# EAGLE design Extender-TI74 (EAGLE 7.7.0)
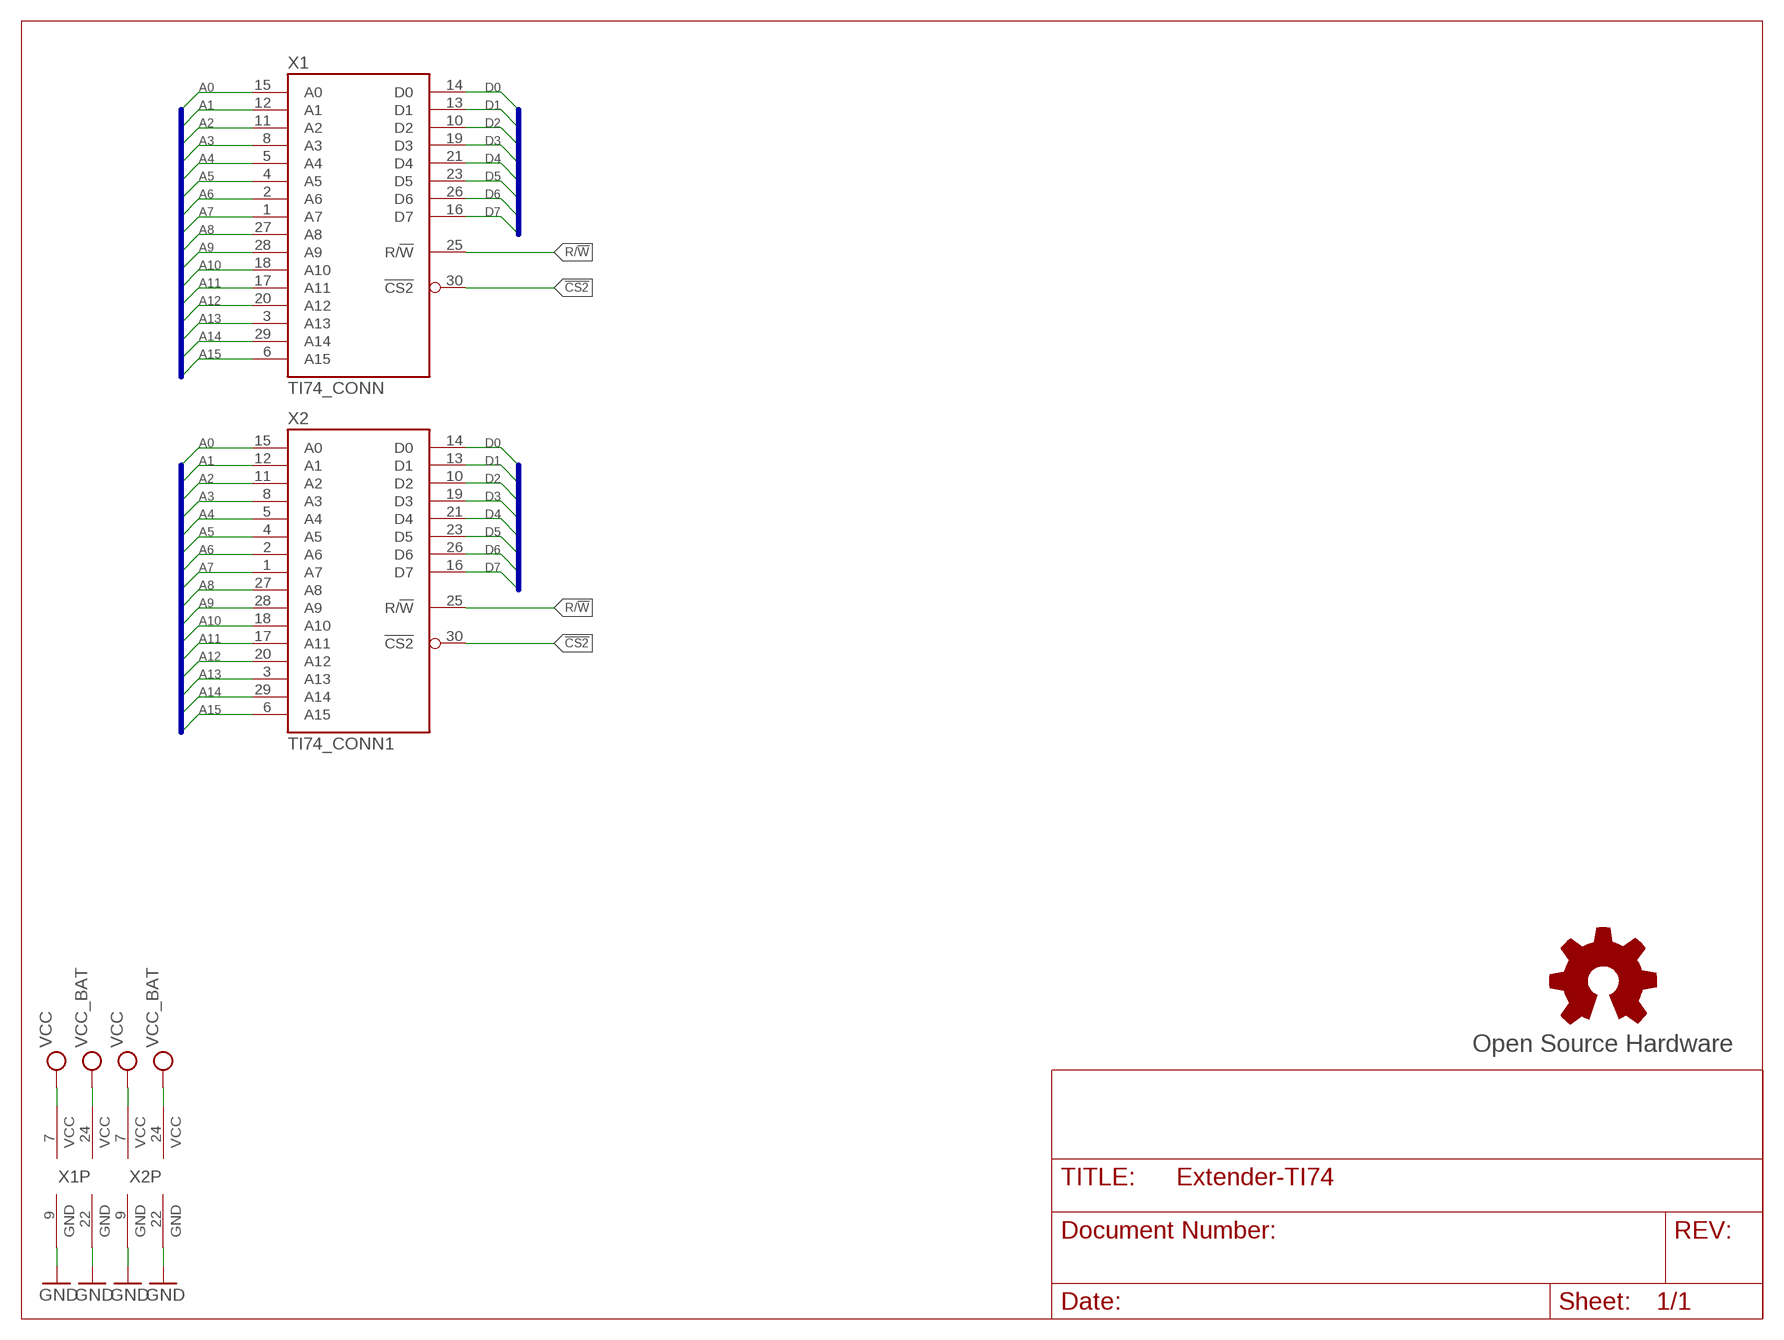
[diagram p0: schematic, sheet 1]

## Parts
GOLD_ORB_SM1  Open Source Hardware  OSHWLOGOLOGO5MM  [OSHW_5MM]
X1  TI74_CONN  [FE050-15-2SHORT]
X2  TI74_CONN1  [MA050-15-2]

## Nets
!CS2: X1.30(!CS2) X2.30(!CS2)
A0: X1.15(A0) X2.15(A0)
A1: X1.12(A1) X2.12(A1)
A2: X1.11(A2) X2.11(A2)
A3: X1.8(A3) X2.8(A3)
A4: X1.5(A4) X2.5(A4)
A5: X1.4(A5) X2.4(A5)
A6: X1.2(A6) X2.2(A6)
A7: X1.1(A7) X2.1(A7)
A8: X1.27(A8) X2.27(A8)
A9: X1.28(A9) X2.28(A9)
A10: X1.18(A10) X2.18(A10)
A11: X1.17(A11) X2.17(A11)
A12: X1.20(A12) X2.20(A12)
A13: X1.3(A13) X2.3(A13)
A14: X1.29(A14) X2.29(A14)
A15: X1.6(A15) X2.6(A15)
D0: X1.14(D0) X2.14(D0)
D1: X1.13(D1) X2.13(D1)
D2: X1.10(D2) X2.10(D2)
D3: X1.19(D3) X2.19(D3)
D4: X1.21(D4) X2.21(D4)
D5: X1.23(D5) X2.23(D5)
D6: X1.26(D6) X2.26(D6)
D7: X1.16(D7) X2.16(D7)
GND: X1.9(GND) X1.22(GND) X2.9(GND) X2.22(GND)
R/!W: X1.25(R/!W) X2.25(R/!W)
VCC: X1.7(VCC) X2.7(VCC)
VCCBAT: X1.24(VCC_RAM) X2.24(VCC_RAM) ; supply symbol labelled VCC_BAT

## Buses
A[0..15]
D[0..7]

## Library data of the parts
GOLD_ORB_SM1 = oshw:OSHWLOGO: The OSHW logo for PCB layout
X1 X2 = ti74:TI74_CONN

## Board
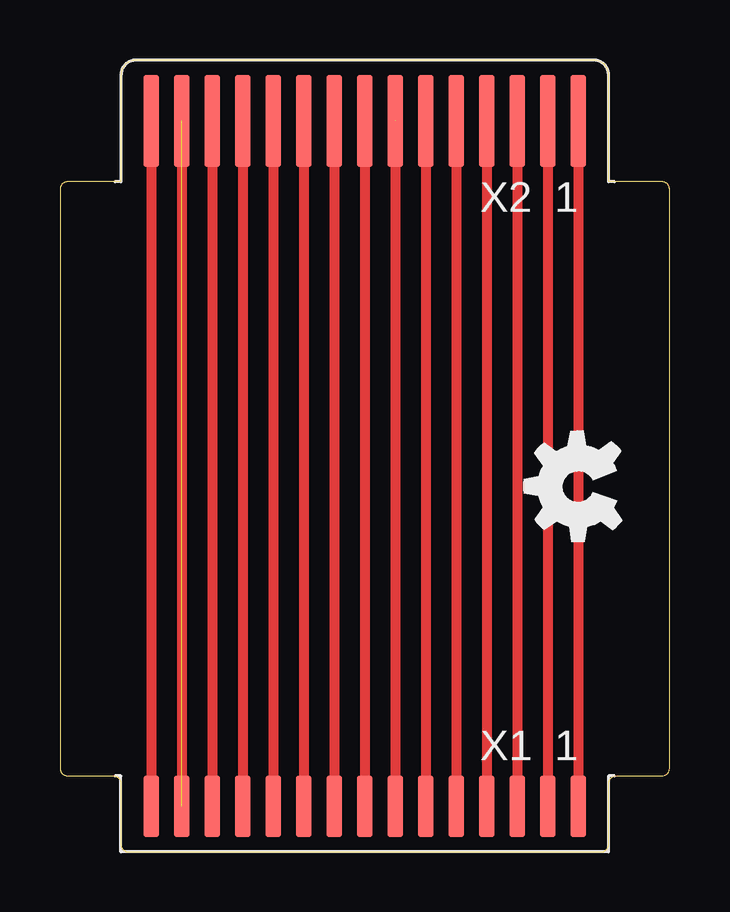
[diagram p1: board, top side]
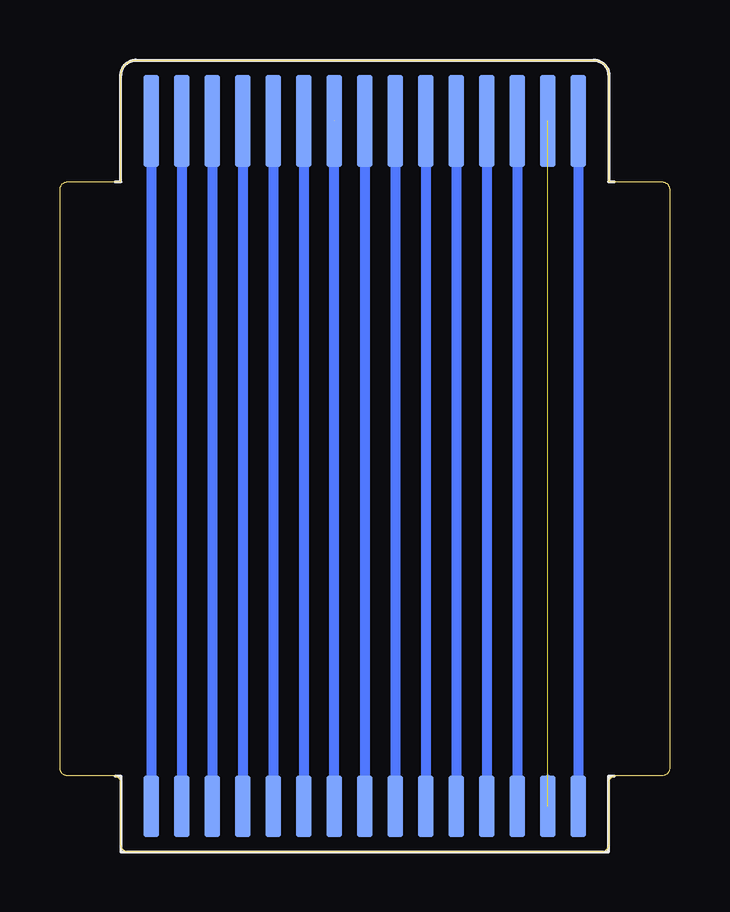
[diagram p2: board, bottom side, seen from below]

Size 25.4 x 33.02 mm. Coordinates in mm from the lower left corner, seen from the top.
Outline: 25.4,3.49 25.4,27.62 arc90 25.08,27.94 22.86,27.94 22.86,32.38 arc90 22.23,33.02 3.17,33.02 arc90 2.54,32.38 2.54,27.94 0.32,27.94 arc90 0,27.62 0,3.49 arc90 0.32,3.17 2.22,3.17 arc-90 2.54,2.86 2.54,0.32 arc90 2.86,0 22.54,0 arc90 22.86,0.32 22.86,2.86 arc-90 23.18,3.17 25.08,3.17 arc90 25.4,3.49
Copper layers (1*16): Top 0.035mm / dielectric 1.5mm / Bottom 0.035mm
Design rules "hackvana *": minimum track width 6mil, minimum drill 0.3mm, track to track 6mil, track to pad 6mil, pad to pad 6mil, via to via 6mil, smd to smd 0mil, copper to edge 6mil, drill to drill 6mil, minimum pad ring 10mil, minimum via ring 6mil, stop-mask expansion 2mil, vias tented up to drill 100mil, thermal gap 10mil

### Footprints (pad centres in the part's own frame; a part is rotated, then mirrored left to right if it is on the bottom)
FE050-15-2SHORT = smd 0.635 x 2.54: 1 8.89,0; 2 7.62,0; 3 6.35,0; 4 5.08,0; 5 3.81,0; 6 2.54,0; 7 1.27,0; 8 0,0; 9 -1.27,0; 10 -2.54,0; 11 -3.81,0; 12 -5.08,0; 13 -6.35,0; 14 -7.62,0; 15 -8.89,0 | smd 0.635 x 2.54 bottom: 16 -8.89,0; 17 -7.62,0; 18 -6.35,0; 19 -5.08,0; 20 -3.81,0; 21 -2.54,0; 22 -1.27,0; 23 0,0; 24 1.27,0; 25 2.54,0; 26 3.81,0; 27 5.08,0; 28 6.35,0; 29 7.62,0; 30 8.89,0
MA050-15-2 = smd 0.635 x 3.81: 1 8.89,0; 2 7.62,0; 3 6.35,0; 4 5.08,0; 5 3.81,0; 6 2.54,0; 7 1.27,0; 8 0,0; 9 -1.27,0; 10 -2.54,0; 11 -3.81,0; 12 -5.08,0; 13 -6.35,0; 14 -7.62,0; 15 -8.89,0 | smd 0.635 x 3.81 bottom: 16 -8.89,0; 17 -7.62,0; 18 -6.35,0; 19 -5.08,0; 20 -3.81,0; 21 -2.54,0; 22 -1.27,0; 23 0,0; 24 1.27,0; 25 2.54,0; 26 3.81,0; 27 5.08,0; 28 6.35,0; 29 7.62,0; 30 8.89,0

### Placement (x,y rotation side)
GOLD_ORB_SM1  21.59,15.24 90 top
X1  12.7,1.91 180 top
X2  12.7,30.48 180 top

### Tracks (layer width: path | path; a pad name or v marks a point on that pad's centre or on a via)
!CS2
  Bottom 0.406: X2.30 X1.30
A0
  Top 0.152: X1.15 21.59,3.17
  Top 0.406: X2.15 X1.15
A1
  Top 0.406: X2.12 X1.12
A2
  Top 0.152: X1.11 16.51,3.17
  Top 0.406: X2.11 X1.11
A3
  Top 0.406: X2.8 X1.8 12.7,1.27
A4
  Top 0.406: X2.5 X1.5
A5
  Top 0.406: X2.4 X1.4
A6
  Top 0.406: X2.2 X1.2
A7
  Top 0.406: X2.1 X1.1
A8
  Bottom 0.152: X1.27 7.62,2.54 7.62,3.17
  Bottom 0.406: X2.27 7.62,2.54
A9
  Bottom 0.152: X1.28 6.35,3.17
  Bottom 0.406: X2.28 X1.28
A10
  Bottom 0.152: X1.18 19.05,3.17
  Bottom 0.406: X2.18 X1.18
A11
  Bottom 0.406: X2.17 X1.17
A12
  Bottom 0.406: X2.20 X1.20
A13
  Top 0.406: X2.3 X1.3
A14  (1 unrouted)
  Bottom 0.152: X1.29 5.08,3.17
A15
  Top 0.406: X2.6 X1.6
D0
  Top 0.406: X2.14 X1.14
D1
  Top 0.152: X1.13 19.05,3.17
  Top 0.406: X2.13 X1.13
D2
  Top 0.406: X2.10 X1.10
D3
  Bottom 0.152: X1.19 17.78,3.17
  Bottom 0.406: X2.19 X1.19
D4
  Bottom 0.152: X1.21 15.24,3.17
  Bottom 0.406: X2.21 X1.21
D5
  Bottom 0.152: X1.23 12.7,3.17
  Bottom 0.406: X2.23 X1.23
D6
  Bottom 0.152: X1.26 8.89,3.17
  Bottom 0.406: X2.26 X1.26
D7
  Bottom 0.406: X2.16 X1.16
GND  (1 unrouted)
  Top 0.406: X2.22 X1.22
  Bottom 0.406: X1.22 X2.22
R/!W
  Bottom 0.406: X2.25 X1.25
VCC
  Top 0.406: X2.7 X1.7
VCCBAT
  Bottom 0.406: X2.24 X1.24